# EAGLE design StackBreakoutConnection_4layers_V1.0_with_PicoBlade (EAGLE 9.6.2)

## Sheet 1 of 2
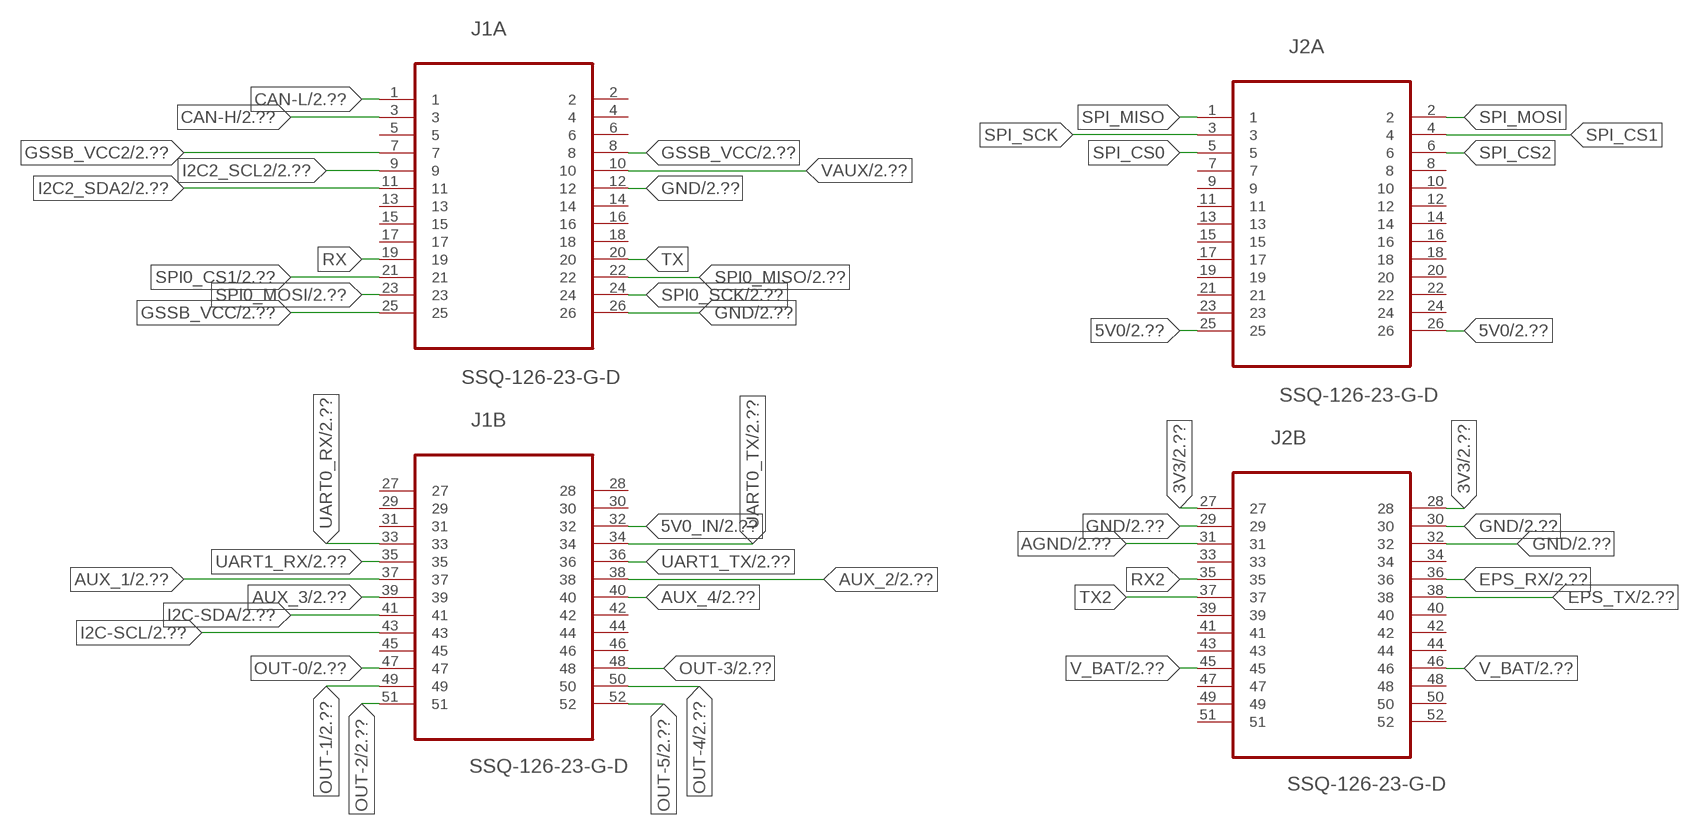
[diagram p0: schematic, sheet 1]

### Parts
J1  SSQ-126-23-G-D  [SAMTEC_SSQ-126-23-G-D]
J2  SSQ-126-23-G-D  [SAMTEC_SSQ-126-23-G-D]

### Nets
3V3: J2.27 J2.28 ; also sheet 2
5V0: J2.25 J2.26 ; also sheet 2
5V0_IN: J1.32 ; also sheet 2
AGND: J2.31 ; also sheet 2
AUX_1: J1.37 ; also sheet 2
AUX_2: J1.38 ; also sheet 2
AUX_3: J1.39 ; also sheet 2
AUX_4: J1.40 ; also sheet 2
CAN-H: J1.3 ; also sheet 2
CAN-L: J1.1 ; also sheet 2
EPS_RX: J2.36 ; also sheet 2
EPS_TX: J2.38 ; also sheet 2
GND: J1.12 J1.26 J2.29 J2.30 J2.32 ; also sheet 2
GSSB_VCC: J1.8 J1.25 ; also sheet 2
GSSB_VCC2: J1.7 ; also sheet 2
I2C2_SCL2: J1.9 ; also sheet 2
I2C2_SDA2: J1.11 ; also sheet 2
I2C-SCL: J1.43 ; also sheet 2
I2C-SDA: J1.41 ; also sheet 2
OUT-0: J1.47 ; also sheet 2
OUT-1: J1.49 ; also sheet 2
OUT-2: J1.51 ; also sheet 2
OUT-3: J1.48 ; also sheet 2
OUT-4: J1.50 ; also sheet 2
OUT-5: J1.52 ; also sheet 2
RX: J1.19
RX2: J2.35
SPI0_CS1: J1.21 ; also sheet 2
SPI0_MISO: J1.22 ; also sheet 2
SPI0_MOSI: J1.23 ; also sheet 2
SPI0_SCK: J1.24 ; also sheet 2
SPI_CS0: J2.5
SPI_CS1: J2.4
SPI_CS2: J2.6
SPI_MISO: J2.1
SPI_MOSI: J2.2
SPI_SCK: J2.3
TX: J1.20
TX2: J2.37
UART0_RX: J1.33 ; also sheet 2
UART0_TX: J1.34 ; also sheet 2
UART1_RX: J1.35 ; also sheet 2
UART1_TX: J1.36 ; also sheet 2
V_BAT: J2.45 J2.46 ; also sheet 2
VAUX: J1.10 ; also sheet 2
Unconnected: J1.2 J1.4 J1.5 J1.6 J1.13 J1.14 J1.15 J1.16 J1.17 J1.18 J1.27 J1.28 J1.29 J1.30 J1.31 J1.42 J1.44 J1.45 J1.46 J2.7 J2.8 J2.9 J2.10 J2.11 J2.12 J2.13 J2.14 J2.15 J2.16 J2.17 J2.18 J2.19 J2.20 J2.21 J2.22 J2.23 J2.24 J2.33 J2.34 J2.39 J2.40 J2.41 J2.42 J2.43 J2.44 J2.47 J2.48 J2.49 J2.50 J2.51 J2.52

## Sheet 2 of 2
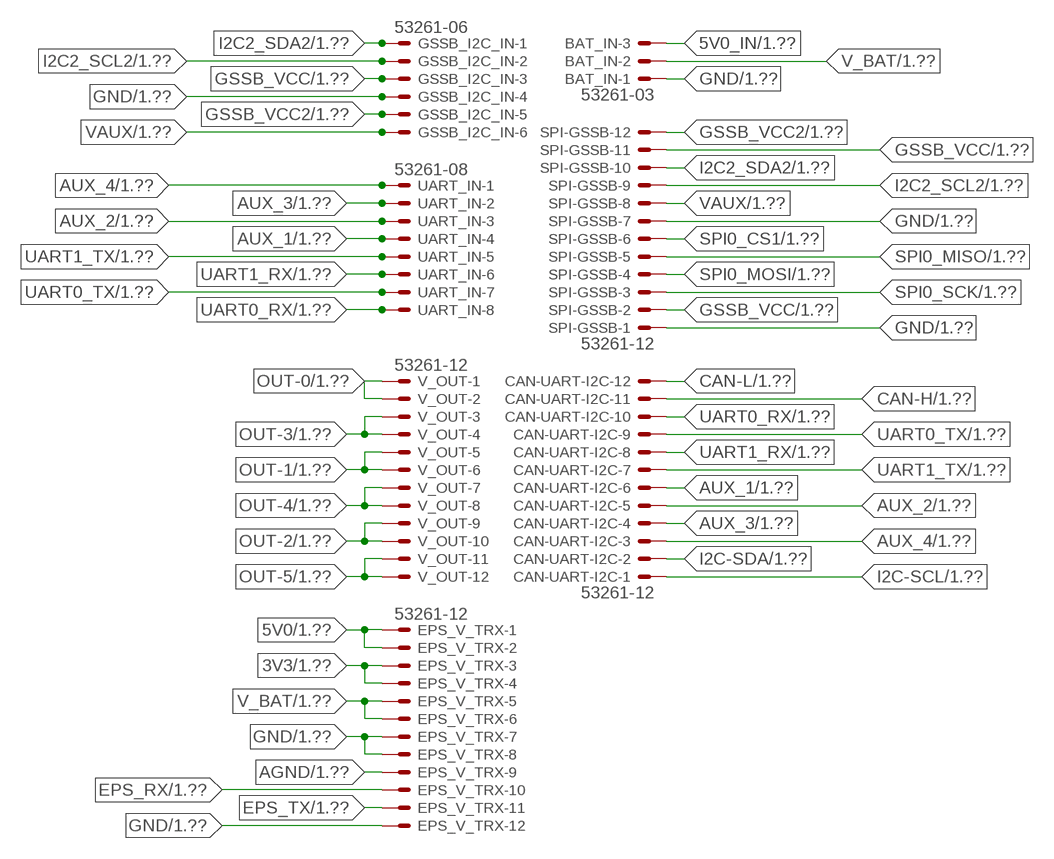
[diagram p1: schematic, sheet 2]

### Parts
BAT_IN  53261-03  [53261-03]
CAN-UART-I2C  53261-12  [53261-12]
EPS_V_TRX  53261-12  [53261-12]
GSSB_I2C_IN  53261-06  [53261-06]
SPI-GSSB  53261-12  [53261-12]
UART_IN  53261-08  [53261-08]
V_OUT  53261-12  [53261-12]

### Nets
3V3: EPS_V_TRX.3 EPS_V_TRX.4 ; also sheet 1
5V0: EPS_V_TRX.1 EPS_V_TRX.2 ; also sheet 1
5V0_IN: BAT_IN.3 ; also sheet 1
AGND: EPS_V_TRX.9 ; also sheet 1
AUX_1: CAN-UART-I2C.6 UART_IN.4 ; also sheet 1
AUX_2: CAN-UART-I2C.5 UART_IN.3 ; also sheet 1
AUX_3: CAN-UART-I2C.4 UART_IN.2 ; also sheet 1
AUX_4: CAN-UART-I2C.3 UART_IN.1 ; also sheet 1
CAN-H: CAN-UART-I2C.11 ; also sheet 1
CAN-L: CAN-UART-I2C.12 ; also sheet 1
EPS_RX: EPS_V_TRX.10 ; also sheet 1
EPS_TX: EPS_V_TRX.11 ; also sheet 1
GND: BAT_IN.1 EPS_V_TRX.7 EPS_V_TRX.8 EPS_V_TRX.12 GSSB_I2C_IN.4 SPI-GSSB.1 SPI-GSSB.7 ; also sheet 1
GSSB_VCC: GSSB_I2C_IN.3 SPI-GSSB.2 SPI-GSSB.11 ; also sheet 1
GSSB_VCC2: GSSB_I2C_IN.5 SPI-GSSB.12 ; also sheet 1
I2C2_SCL2: GSSB_I2C_IN.2 SPI-GSSB.9 ; also sheet 1
I2C2_SDA2: GSSB_I2C_IN.1 SPI-GSSB.10 ; also sheet 1
I2C-SCL: CAN-UART-I2C.1 ; also sheet 1
I2C-SDA: CAN-UART-I2C.2 ; also sheet 1
OUT-0: V_OUT.1 V_OUT.2 ; also sheet 1
OUT-1: V_OUT.5 V_OUT.6 ; also sheet 1
OUT-2: V_OUT.9 V_OUT.10 ; also sheet 1
OUT-3: V_OUT.3 V_OUT.4 ; also sheet 1
OUT-4: V_OUT.7 V_OUT.8 ; also sheet 1
OUT-5: V_OUT.11 V_OUT.12 ; also sheet 1
SPI0_CS1: SPI-GSSB.6 ; also sheet 1
SPI0_MISO: SPI-GSSB.5 ; also sheet 1
SPI0_MOSI: SPI-GSSB.4 ; also sheet 1
SPI0_SCK: SPI-GSSB.3 ; also sheet 1
UART0_RX: CAN-UART-I2C.10 UART_IN.8 ; also sheet 1
UART0_TX: CAN-UART-I2C.9 UART_IN.7 ; also sheet 1
UART1_RX: CAN-UART-I2C.8 UART_IN.6 ; also sheet 1
UART1_TX: CAN-UART-I2C.7 UART_IN.5 ; also sheet 1
V_BAT: BAT_IN.2 EPS_V_TRX.5 EPS_V_TRX.6 ; also sheet 1
VAUX: GSSB_I2C_IN.6 SPI-GSSB.8 ; also sheet 1

## Library data of the parts
BAT_IN = con-molex:53?-03: CONNECTOR wire to board 1.25 mm (.049 inch) pitch header; MF: MOLEX; MPN: 53261-0390; OC_FARNELL: 1125359; OC_NEWARK: 57H5006
CAN-UART-I2C EPS_V_TRX SPI-GSSB V_OUT = con-molex:53?-12: CONNECTOR wire to board 1.25 mm (.049 inch) pitch header; MF: MOLEX; MPN: 53261-1271; OC_FARNELL: 1125363; OC_NEWARK: 59J0244
GSSB_I2C_IN = con-molex:53?-06: CONNECTOR wire to board 1.25 mm (.049 inch) pitch header; MF: MOLEX; OC_FARNELL: 1125375; OC_NEWARK: unknown
J1 J2 = SPEL:SSQ-126-23-G-D: CONN RECEPTACLE, 2.54MM, DUAL, 52WAY; MPN: SSQ-126-23-G-D; OC_FARNELL: -; OC_NEWARK: 82P0504; PACKAGE: RECEPTACLE, 2.54MM, DUAL, 52WAY; SUPPLIER: Samtec
UART_IN = con-molex:53?-08: CONNECTOR wire to board 1.25 mm (.049 inch) pitch header; MF: MOLEX; OC_FARNELL: 1125376; OC_NEWARK: unknown

## Board
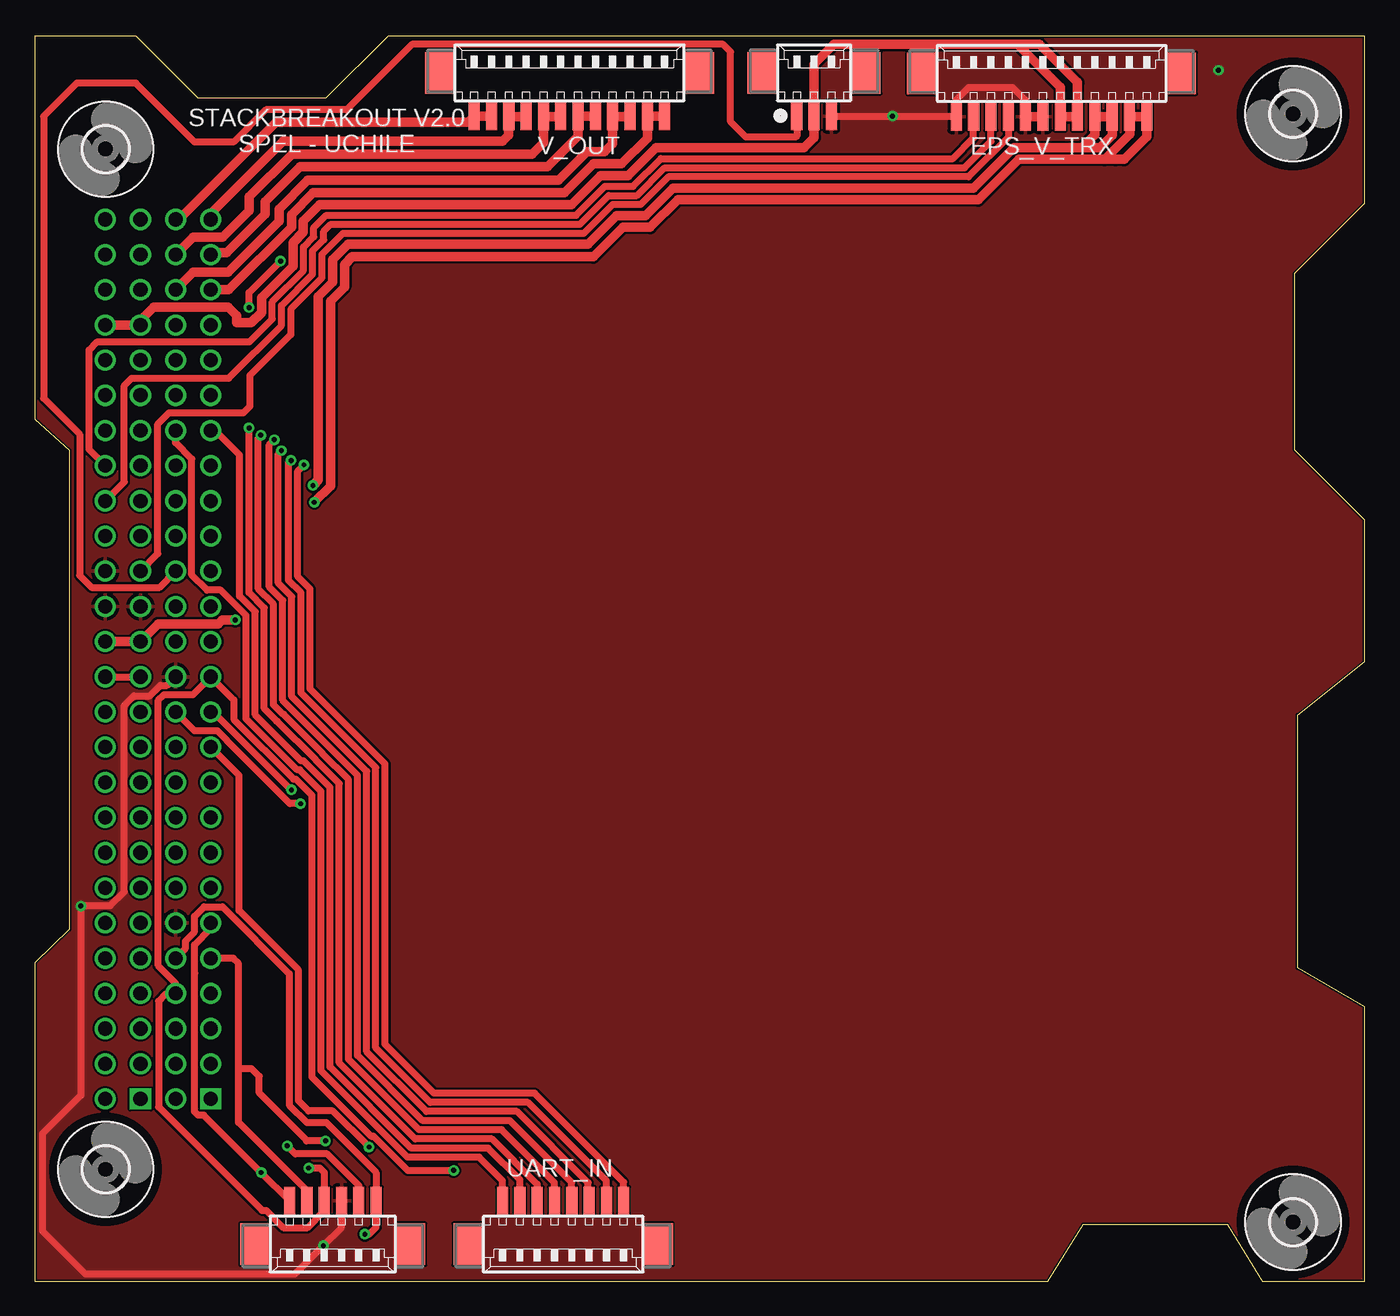
[diagram p2: board, top side]
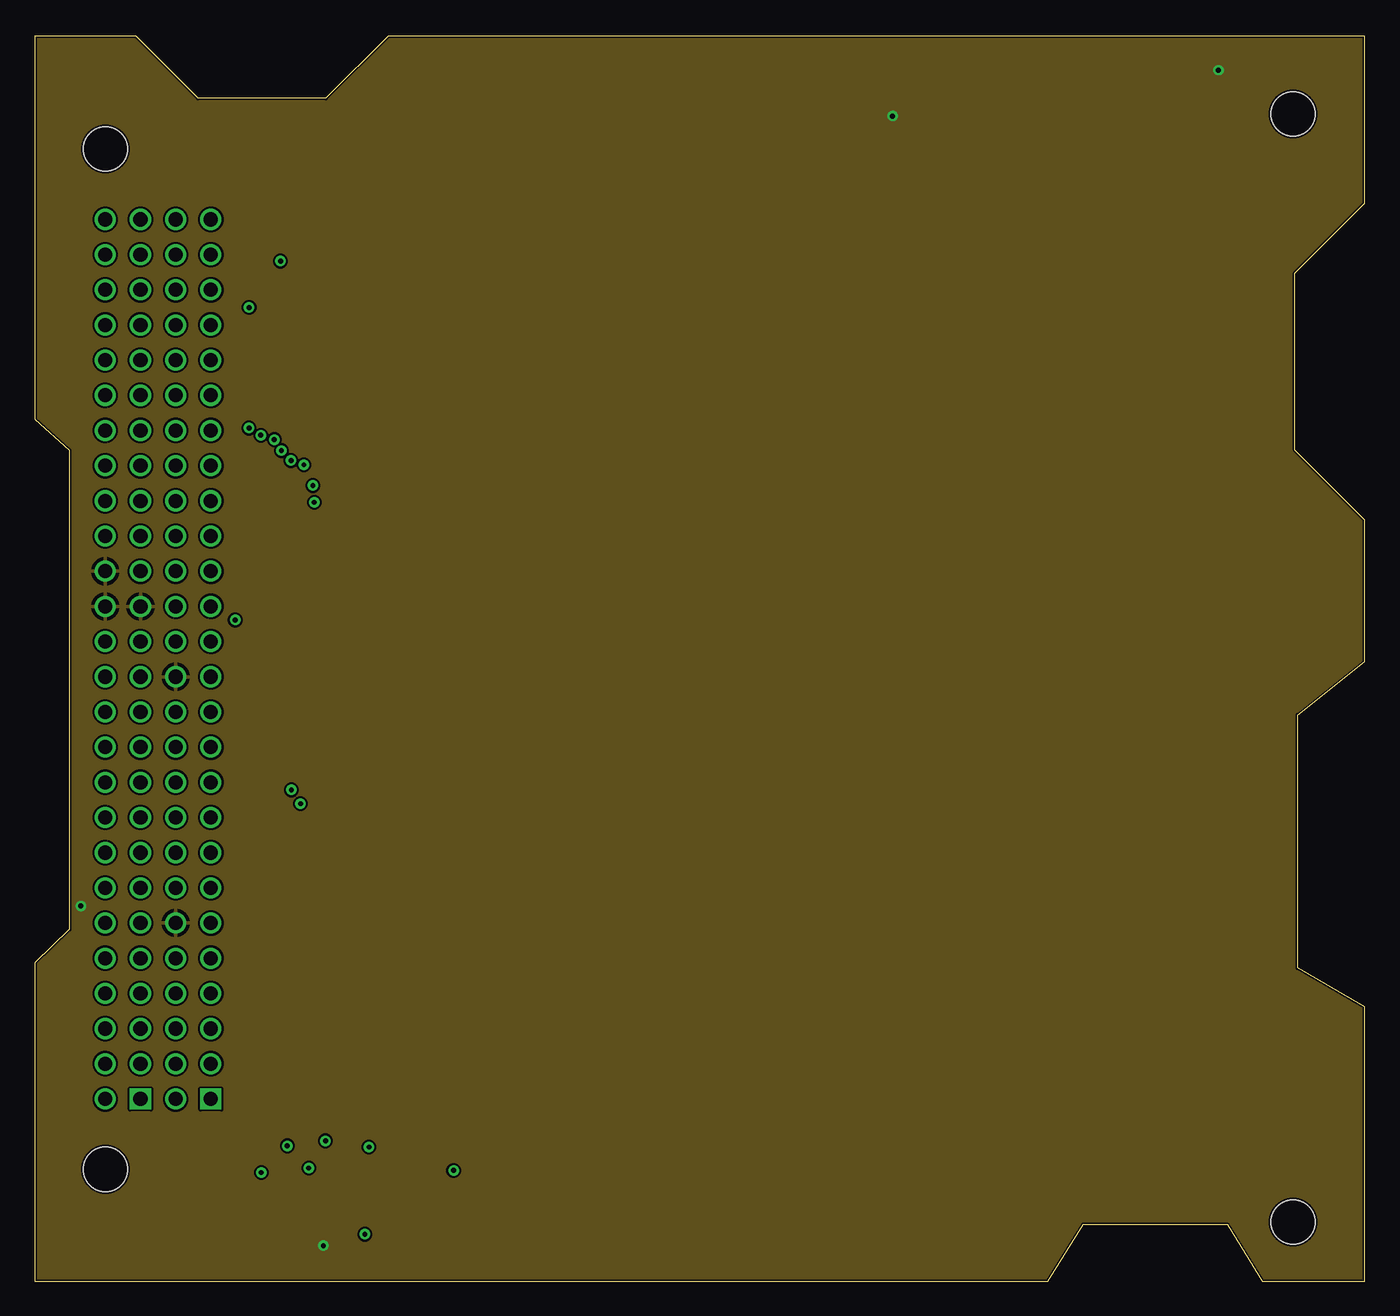
[diagram p3: board, inner layer Route2]
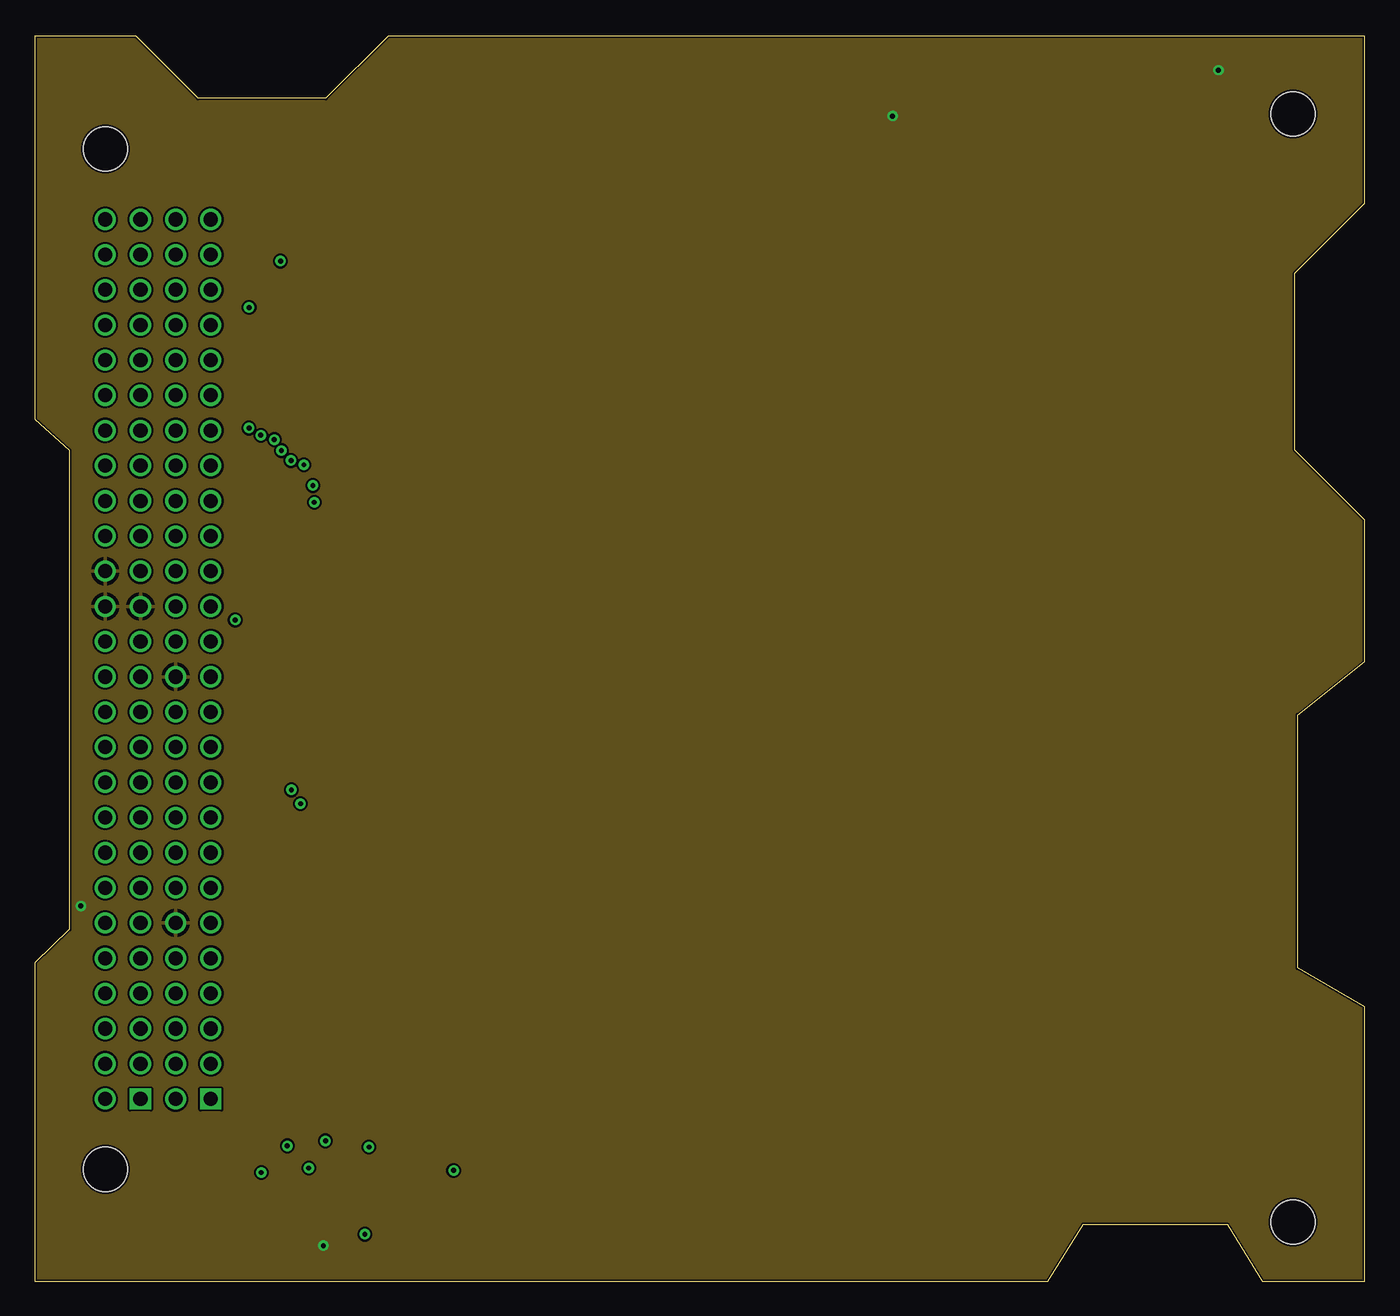
[diagram p4: board, inner layer Route15]
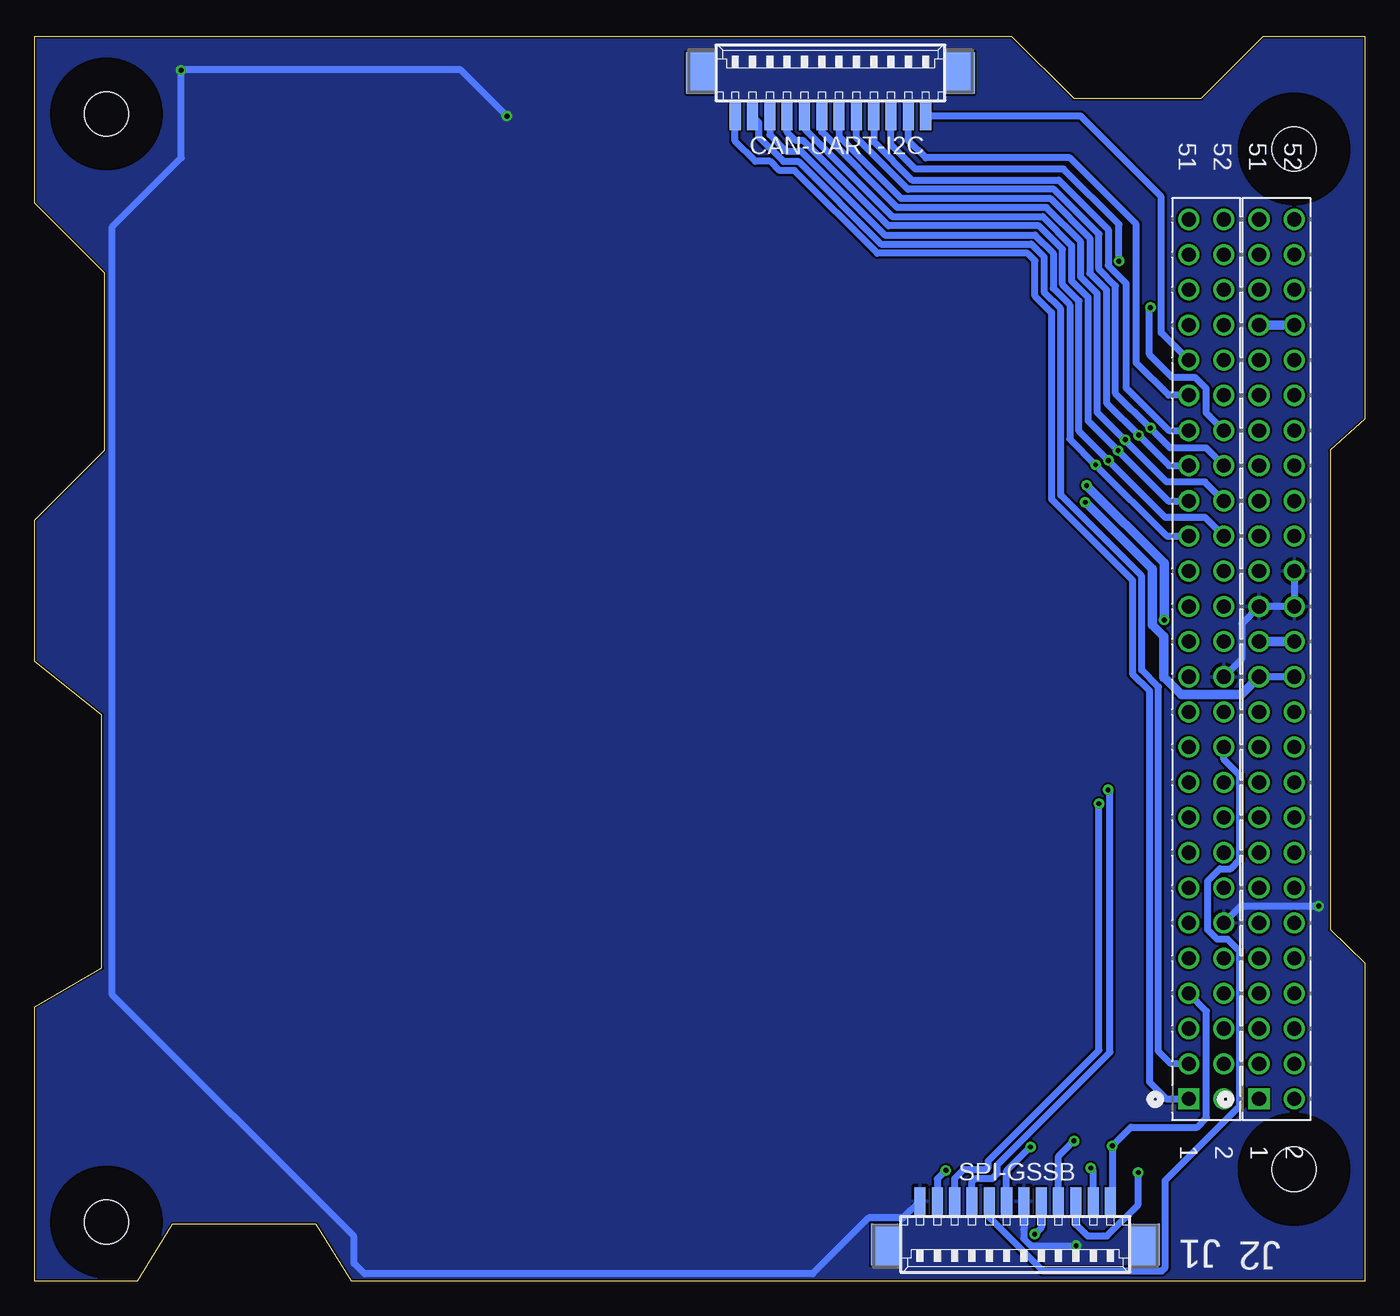
[diagram p5: board, bottom side, seen from below]

Size 96.04 x 89.88 mm. Coordinates in mm from the lower left corner, seen from the top.
Outline: 90.98,72.77 96.04,77.83 96.04,89.88 25.51,89.88 21.02,85.4 11.8,85.4 7.32,89.88 0,89.88 0,62.23 2.5,60 2.5,25.4 0,23 0,0 73.15,0 75.7,4.1 86.09,4.1 88.65,0 96.01,0 96.01,19.81 91.19,22.61 91.19,40.89 96.04,44.76 96.04,54.97 90.98,60.02 90.98,72.77
Copper layers (1+2*15+16): Top 0.035mm / dielectric 1.5mm / Route2 0.035mm / dielectric 0.15mm / Route15 0.035mm / dielectric 0.2mm / Bottom 0.035mm
Design rules "default *": minimum track width 20mil, minimum drill 0.2mm, track to track 6mil, track to pad 6mil, pad to pad 6mil, via to via 6mil, smd to smd 6mil, copper to edge 6mil, drill to drill 6mil, minimum pad ring 10mil, minimum via ring 8mil, stop-mask expansion 4mil, vias tented up to drill 0mil, thermal gap 10mil

### Footprints (pad centres in the part's own frame; a part is rotated, then mirrored left to right if it is on the bottom)
53261-03 = smd 0.8 x 2: 1 1.25,-2.5; 2 0,-2.5; 3 -1.25,-2.5 | smd 2.1 x 3: S1 3.75,0.625; S2 -3.75,0.625
53261-12 = smd 0.8 x 2: 1 6.875,-2.5; 2 5.625,-2.5; 3 4.375,-2.5; 4 3.125,-2.5; 5 1.875,-2.5; 6 0.625,-2.5; 7 -0.625,-2.5; 8 -1.875,-2.5; 9 -3.125,-2.5; 10 -4.375,-2.5; 11 -5.625,-2.5; 12 -6.875,-2.5 | smd 2.1 x 3: S1 9.375,0.625; S2 -9.375,0.625
3,2 = hole 3.2: 0,0
53261-06 = smd 0.8 x 2: 1 3.125,-2.5; 2 1.875,-2.5; 3 0.625,-2.5; 4 -0.625,-2.5; 5 -1.875,-2.5; 6 -3.125,-2.5 | smd 2.1 x 3: S1 5.625,0.625; S2 -5.625,0.625
SAMTEC_SSQ-126-23-G-D = drill 1.016 square: 1 63.5,-2.54 | drill 1.016: 2 63.5,0; 3 60.96,-2.54; 4 60.96,0; 5 58.42,-2.54; 6 58.42,0; 7 55.88,-2.54; 8 55.88,0; 9 53.34,-2.54; 10 53.34,0; 11 50.8,-2.54; 12 50.8,0; 13 48.26,-2.54; 14 48.26,0; 15 45.72,-2.54; 16 45.72,0; 17 43.18,-2.54; 18 43.18,0; 19 40.64,-2.54; 20 40.64,0; 21 38.1,-2.54; 22 38.1,0; 23 35.56,-2.54; 24 35.56,0; 25 33.02,-2.54; 26 33.02,0; 27 30.48,-2.54; 28 30.48,0; 29 27.94,-2.54; 30 27.94,0; 31 25.4,-2.54; 32 25.4,0; 33 22.86,-2.54; 34 22.86,0; 35 20.32,-2.54; 36 20.32,0; 37 17.78,-2.54; 38 17.78,0; 39 15.24,-2.54; 40 15.24,0; 41 12.7,-2.54; 42 12.7,0; 43 10.16,-2.54; 44 10.16,0; 45 7.62,-2.54; 46 7.62,0; 47 5.08,-2.54; 48 5.08,0; 49 2.54,-2.54; 50 2.54,0; 51 0,-2.54; 52 0,0
53261-08 = smd 0.8 x 2: 1 4.375,-2.5; 2 3.125,-2.5; 3 1.875,-2.5; 4 0.625,-2.5; 5 -0.625,-2.5; 6 -1.875,-2.5; 7 -3.125,-2.5; 8 -4.375,-2.5 | smd 2.1 x 3: S1 6.875,0.625; S2 -6.875,0.625

### Placement (x,y rotation side)
BAT_IN  56.27,86.62 0 top
CAN-UART-I2C  38.58,86.62 0 bottom
EPS_V_TRX  73.42,86.58 0 top
GND  [3,2]  90.85,4.27 0 top
GSSB_I2C_IN  21.53,3.3 180 top
J1  10.18,76.66 270 bottom
J2  5.1,76.66 270 bottom
SPI-GSSB  25.24,3.28 180 bottom
U$1  [3,2]  5.12,81.74 0 top
U$2  [3,2]  90.85,84.28 0 top
U$4  [3,2]  5.12,8.08 0 top
UART_IN  38.16,3.3 180 top
V_OUT  38.61,86.61 0 top

### Tracks (layer width: path | path; a pad name or v marks a point on that pad's centre or on a via)
3V3  (via drill 0.35)
  Top 0.7: J2.28 J2.27 | J2.27 7.82,46.18 | 75.6,81.85 70.7,81.85 67.78,78.93 46.08,78.93 44.09,76.94 42.03,76.94 39.96,74.87 22.64,74.87 21.52,73.76 21.52,72.13 20.48,71.09 20.48,57.84 v20.09,57.45 | 75.6,81.85 76.54,82.79 EPS_V_TRX.4 EPS_V_TRX.3 77.79,82.74 76.9,81.85 75.6,81.85 | v14.48,47.74 13.53,47.74 13.24,47.46 8.92,47.46 J2.27
  Bottom 0.7: J2.28 J2.27 | v20.09,57.45 14.48,51.84 v14.48,47.74
5V0  (via drill 0.35)
  Top 0.508: J2.26 J2.25
  Top 0.7: 77.25,81 79.06,82.81 79.06,84.05 EPS_V_TRX.2 EPS_V_TRX.1 80.29,82.63 78.66,81 78.03,81 77.25,81 | 77.25,81 71.06,81 68.14,78.08 46.43,78.08 44.44,76.09 42.47,76.09 40.34,73.96 22.93,73.96 22.37,73.4 22.37,71.77 21.35,70.75 21.35,57.4 v20.19,56.24
  Bottom 0.508: J2.26 J2.25
  Bottom 0.7: v20.19,56.24 15.36,51.41 15.36,47.38 14.52,46.53 14.52,43.6 14.47,43.6 13.24,42.38 8.9,42.38 J2.25
5V0_IN
  Top 0.508: BAT_IN.3 55.02,82.67 54.95,82.6 51.35,82.6 50.25,83.7 50.25,88.75 49.7,89.3 27.25,89.3 22.52,84.57 16.68,84.57 14.36,82.25 11.55,82.25 7.3,86.5 3.05,86.5 0.65,84.1 0.65,63.75 3.25,61.15 3.25,50.95 4.11,50.09 9.01,50.09 J1.32
AGND
  Top 0.508: EPS_V_TRX.9 70.29,82.59 67.43,79.73 45.76,79.73 43.76,77.73 41.72,77.73 39.63,75.64 22.25,75.64 20.73,74.12 20.73,72.42 18.49,70.18 18.49,68.34 15.56,65.41 15.56,63.18 15.08,62.7 9.7,62.7 8.9,61.9 8.9,52.52 J2.31
AUX_1  (via drill 0.35)
  Top 0.508: UART_IN.4 37.53,7.12 33.72,10.93 27.74,10.93 22.65,16.02 22.65,36.21 20.79,38.07 20.79,38.12 17.99,40.92 17.94,40.92 17.25,41.62 17.25,48.89 16.14,49.99 16.14,60.89 v16.33,61.08
  Bottom 0.508: CAN-UART-I2C.6 37.96,82.66 33.48,78.18 22.71,78.18 19.86,75.32 19.86,72.78 18.66,71.58 18.66,63.41 v16.33,61.08 14.13,58.88 J1.37
AUX_2  (via drill 0.35)
  Top 0.508: UART_IN.3 36.29,7.01 33.02,10.27 27.47,10.27 21.99,15.75 21.99,35.92 20.31,37.61 20.31,37.62 17.51,40.42 | 17.51,40.42 17.47,40.42 | 17.51,40.42 16.59,41.34 16.59,48.61 15.48,49.72 v15.48,61.6
  Bottom 0.508: J1.38 11.45,60.15 14.05,60.15 15.48,61.58 | 15.48,61.58 18,64.1 18,71.86 19.2,73.05 19.2,75.59 22.44,78.84 32.97,78.84 36.71,82.57 CAN-UART-I2C.5 | v15.48,61.6 15.48,61.58
AUX_3
  Top 0.508: UART_IN.2 35.03,7.33 32.75,9.61 27.2,9.61 21.33,15.48 21.33,35.65 19.41,37.58 19.23,37.58 15.93,40.88 15.93,48.34 14.8,49.46 14.8,59.65 13.03,61.42 J1.39
  Bottom 0.508: CAN-UART-I2C.4 35.46,82.26 32.7,79.5 22.1,79.5 18.54,75.94 18.54,73.33 17.25,72.04 17.25,64.5 14.17,61.42 J1.39
AUX_4  (via drill 0.35)
  Top 0.508: v15.48,70.3 15.48,71.39 v17.75,73.65 | UART_IN.1 33.78,7.26 32.09,8.95 26.92,8.95 20.67,15.2 20.67,35.38 19.13,36.91 18.96,36.91 15.27,40.61 15.27,48.06 13.44,49.89 12.44,49.89 11.35,50.98 11.35,59.36 10.18,60.53 J1.40
  Bottom 0.508: J1.40 11.45,62.69 11.45,64.45 12.25,65.25 13.9,65.25 15.55,66.9 15.55,70.23 v15.48,70.3 | v17.75,73.65 17.75,76.3 21.75,80.3 32.45,80.3 34.21,82.06 CAN-UART-I2C.3
CAN-H
  Bottom 0.508: CAN-UART-I2C.11 43.77,83.67 43.77,82.63 41.98,80.85 40.9,80.85 34.93,74.88 24.08,74.88 23.16,73.95 23.16,71.41 21.96,70.22 21.96,56.74 16.12,50.9 16.12,44.13 14.9,42.91 14.9,16.6 14,15.7 J1.3
CAN-L
  Bottom 0.508: CAN-UART-I2C.12 45.46,82.31 44,80.85 42.92,80.85 42.26,80.19 41.17,80.19 35.2,74.22 24.35,74.22 23.82,73.68 23.82,71.14 22.62,69.94 22.62,56.47 16.78,50.62 16.78,43.85 15.56,42.64 15.56,14.39 14.32,13.15 J1.1
EPS_RX
  Top 0.508: J2.36 6.47,57.71 6.47,64.67 7,65.2 14.02,65.2 17.82,69 17.82,70.44 20.07,72.69 20.07,74.39 20.87,75.19 20.87,75.8 21.37,76.3 39.36,76.3 41.45,78.39 43.48,78.39 45.48,80.39 67.14,80.39 69.04,82.29 EPS_V_TRX.10
EPS_TX
  Top 0.508: EPS_V_TRX.11 67.79,82.54 66.3,81.05 45.21,81.05 43.21,79.05 41.18,79.05 39.09,76.96 21.05,76.96 20.16,76.07 20.16,75.41 19.41,74.67 19.41,72.97 17.15,70.71 17.15,69.47 15.52,67.83 4.53,67.83 3.93,67.23 3.93,60.05 J2.38
GND  (via drill 0.35)
  Top 0.508: BAT_IN.1 v61.94,84.12 66.5,84.12 EPS_V_TRX.12 66.54,85.29 67.45,86.2 70.6,86.2 71.54,85.26 EPS_V_TRX.8 | J1.26 9.56,43.02 9.07,43.02 8.31,42.27 7.16,42.27 6.47,41.58 6.47,28.12 5.47,27.12 3.33,27.12 v3.33,27.09 3.33,13.42 0.56,10.65 0.56,3.63 3.67,0.52 18.8,0.52 v20.84,2.56 22.15,3.87 GSSB_I2C_IN.4
  Top 0.7: EPS_V_TRX.8 EPS_V_TRX.7
  Bottom 0.508: J2.32 J2.30 J2.29 8.9,47.46 8.9,44.92 J1.26 | v61.94,84.12 65.27,87.45 85.44,87.45 | 85.44,87.45 v85.46,87.43 | J1.12 8.96,27.08 3.66,27.08 3.65,27.09 v3.33,27.09 | v20.84,2.56 24.12,2.56 24.62,3.06 24.62,3.71 24.61,3.73 SPI-GSSB.7 | 32.1,5.77 SPI-GSSB.1 33.33,4.56 35.83,4.56 39.88,0.52 72.21,0.52 72.98,1.29 72.98,3.23 90.42,20.67 90.42,76.13 85.44,81.11 85.44,87.45
  pour Route15: -0.22,90.12 7.77,90.12 7.77,90.04 12.04,85.77 20.96,85.77 26.02,90.83 96.4,90.83 96.71,90.52 96.71,77.77 91.45,72.52 91.45,60.39 96.5,55.34 96.5,44.84 91.56,39.9 91.56,22.84 96.45,20.03 96.45,-0.36 88.28,-0.36 85.72,3.61 76.26,3.61 73.9,-0.36 -0.35,-0.36 -0.35,23.1 2.23,25.67 2.23,59.72 -0.23,62.18 -0.23,90.12 -0.23,90.12
  pour Top: -0.25,-0.13 73.41,-0.13 76.03,3.81 85.89,3.81 88.6,-0.25 96.27,-0.25 96.27,20.57 91.44,22.99 91.44,40.58 96.27,44.2 96.27,55.24 91.31,60.2 91.31,72.64 96.39,77.72 96.39,90.17 24.89,90.17 20.57,85.85 11.65,85.85 8.22,90.42 -0.25,90.42 -0.25,62.23 2.29,59.69 2.29,25.65 -0.25,23.11
  pour Route2: -0.46,-0.28 73.46,-0.28 76.08,3.66 85.9,3.66 88.53,-0.28 96.32,-0.28 96.32,20.42 91.87,22.64 91.87,40.87 96.32,44.2 96.32,55.22 91.36,60.17 91.36,72.62 96.44,77.7 96.44,90.4 25.32,90.4 20.75,85.83 11.77,85.83 8.62,90.02 -0.2,90.02 -0.2,62.33 2.08,60.05 2.08,25.88 -0.46,23.34
  pour Bottom: -0.27,90.34 7.08,90.34 7.08,90.4 11.74,85.74 11.74,85.86 20.77,85.86 26.09,91.18 95.59,91.18 96.65,90.11 96.65,77.24 91.53,72.11 91.53,60.11 96.71,54.93 96.71,44.56 91.64,39.49 91.64,22.93 96.27,20.25 96.27,-0.51 88.48,-0.51 85.92,3.45 76.54,3.45 74.18,-0.51 -0.4,-0.51 -0.4,23.33 2.18,25.9 2.18,59.57 -0.28,62.03 -0.28,90.35 -0.28,90.35
GSSB_VCC  (via drill 0.35)
  Top 0.508: v19.79,8.17 20.59,8.17 20.9,7.86 GSSB_I2C_IN.3 20.9,5.08 19.7,3.87 17.96,3.87 16.72,5.11 16.41,5.11 8.94,12.58 8.94,20.21 9.51,20.78 J1.8 10.18,21.52 8.93,22.77 8.93,41.95 9.34,42.36 11.44,42.36 J1.25 14.38,41.98 14.38,40.56 18.68,36.26 18.86,36.26 20.01,35.1 20.01,14.75 24.29,10.47 24.46,10.47 26.94,8 v30.25,8
  Bottom 0.508: SPI-GSSB.11 19.61,8 v19.79,8.17 | v30.25,8 30.86,7.38 SPI-GSSB.2
GSSB_VCC2  (via drill 0.35)
  Top 0.508: GSSB_I2C_IN.5 23.4,6.91 21.12,9.19 18.82,9.19 v18.24,9.77
  Bottom 0.508: v18.24,9.77 18.36,9.65 | 18.36,5.79 SPI-GSSB.12 18.24,5.91 v18.24,9.77 | v18.24,9.77 16.89,11.12 12.11,11.12 11.43,11.8 11.43,19.49 J1.7
I2C2_SCL2  (via drill 0.35)
  Top 0.508: GSSB_I2C_IN.2 19.66,6.52 14.72,11.46 14.72,15.35 | 14.72,15.35 14.72,22.94 14.34,23.32 J1.9 | v21,10.13 19.63,10.13 19.65,10.15 16.21,13.6 16.21,14.8 15.66,15.35 14.72,15.35
  Bottom 0.508: SPI-GSSB.9 22.11,9.02 v21,10.13
I2C2_SDA2  (via drill 0.35)
  Top 0.508: GSSB_I2C_IN.1 v16.36,7.84 12.21,11.99 11.79,11.99 11.55,12.23 11.55,22.22 | 11.55,22.22 11.56,22.23 | 11.55,22.22 11.55,24.29 12.72,25.46 J1.11
  Bottom 0.508: SPI-GSSB.10 20.86,4.11 20.03,3.27 18.62,3.27 16.36,5.53 v16.36,7.84
I2C-SCL
  Bottom 0.508: J1.43 14.7,68.48 14.7,78.3 20.52,84.12 CAN-UART-I2C.1
I2C-SDA
  Bottom 0.508: J1.41 14.16,63.96 16.5,66.3 16.5,76.3 21.3,81.1 31.7,81.1 32.96,82.36 CAN-UART-I2C.2
OUT-0
  Top 0.7: V_OUT.1 V_OUT.2 44.23,82.53 42.37,80.67 40.34,80.67 38.25,78.58 20.11,78.58 18.54,77.01 18.54,76.1 14.02,71.58 J1.47
OUT-1
  Top 0.61: J1.49 12.72,74.22 12.76,74.26
  Top 0.7: 12.76,74.26 13.87,74.26 16.65,77.03 16.65,77.92 19.17,80.45 37.01,80.45 39.23,82.67 V_OUT.6 V_OUT.5
OUT-2
  Top 0.508: 34.23,84.07 V_OUT.10 | V_OUT.9 35.44,84.07
  Top 0.61: J1.51 12.64,76.74 12.64,76.99
  Top 0.7: 12.64,76.99 17.95,82.3 33.78,82.3 34.23,82.75 34.23,84.07 35.44,84.07
OUT-3
  Top 0.508: 41.73,84.07 V_OUT.4 | V_OUT.3 42.94,84.07
  Top 0.7: 42.94,84.07 41.73,84.07 41.73,82.12 41.15,81.53 39.88,81.53 37.83,79.48 19.72,79.48 17.66,77.42 17.66,76.55 13.96,72.85 11.45,72.85 J1.48
OUT-4
  Top 0.508: 36.73,84.07 V_OUT.8 | V_OUT.7 37.94,84.07
  Top 0.7: 37.94,84.07 36.73,84.07 36.73,82.2 35.9,81.37 18.57,81.37 15.49,78.29 15.49,77.3 13.58,75.39 11.45,75.39 J1.50
OUT-5
  Top 0.61: J1.52 10.44,76.66
  Top 0.7: 10.44,76.66 17.45,83.66 31.28,83.66 V_OUT.12 V_OUT.11
SPI0_CS1  (via drill 0.35)
  Top 0.508: v24.14,9.69 21.53,12.3 19.78,12.3 19.05,13.03 19.05,22.47 14.76,26.76 14.76,36.52 J1.21
  Bottom 0.508: SPI-GSSB.6 25.86,7.96 v24.14,9.69
SPI0_MISO
  Bottom 0.508: SPI-GSSB.5 27.1,5.77 27.1,4.61 23.24,0.75 14.65,0.75 14.41,0.99 14.41,7.28 9.01,12.68 9.01,23.8 9.9,24.69 10.66,24.69 11.35,25.38 11.35,28.88 10.46,29.77 9.7,29.77 9.01,30.46 9.01,36.5 10.18,37.67 J1.22
SPI0_MOSI  (via drill 0.35)
  Top 0.508: v18.54,35.47 12.9,41.1 J1.23
  Bottom 0.508: SPI-GSSB.4 28.36,7.17 28.11,7.42 26.88,7.42 26.52,7.78 26.52,8.41 18.41,16.53 18.41,35.35 v18.54,35.47
SPI0_SCK  (via drill 0.35)
  Top 0.508: J1.24 11.55,39.73 13.2,39.73 13.89,39.04 13.89,39.01 18.41,34.48 v19.2,34.48
  Bottom 0.508: SPI-GSSB.3 29.61,7.42 28.95,8.08 27.3,8.08 27.19,8.2 27.19,8.69 19.2,16.68 v19.2,34.48
UART0_RX  (via drill 0.35)
  Top 0.508: UART_IN.8 42.53,7.15 36.11,13.57 28.84,13.57 25.29,17.12 25.29,37.35 19.89,42.76 19.89,49.98 18.99,50.88 18.99,58.49 v19.44,58.94
  Bottom 0.508: CAN-UART-I2C.10 42.96,82.76 41.8,81.6 40.72,81.6 34.66,75.54 23.81,75.54 22.5,74.23 22.5,71.68 21.3,70.49 21.3,60.8 v19.44,58.94 14.3,53.8 J1.33
UART0_TX  (via drill 0.35)
  Top 0.508: UART_IN.7 41.28,7.25 35.62,12.91 28.57,12.91 24.63,16.84 24.63,37.08 19.23,42.48 19.23,49.71 18.33,50.6 18.33,59.07 v18.51,59.25
  Bottom 0.508: J1.34 11.53,55.15 14.41,55.15 v18.51,59.25 20.64,61.38 20.64,70.76 21.84,71.96 21.84,74.5 23.53,76.2 34.38,76.2 40.53,82.35 41.1,82.35 41.71,82.96 CAN-UART-I2C.9
UART1_RX  (via drill 0.35)
  Top 0.508: UART_IN.6 39.97,5.86 39.97,7.11 34.83,12.25 28.29,12.25 23.97,16.57 23.97,36.81 18.57,42.21 18.57,49.43 17.6,50.4 17.6,59.75 v17.82,59.97
  Bottom 0.508: CAN-UART-I2C.8 40.46,83.21 34.11,76.86 23.26,76.86 21.18,74.77 21.18,72.23 19.98,71.04 19.98,62.13 v17.82,59.97 14.19,56.34 J1.35
UART1_TX  (via drill 0.35)
  Top 0.508: UART_IN.5 38.78,7.13 34.32,11.59 28.02,11.59 23.31,16.3 23.31,36.53 17.91,41.94 17.91,49.16 16.94,50.13 16.94,60.4 v17.3,60.76
  Bottom 0.508: J1.36 11.55,57.71 14.31,57.71 17.35,60.76 | CAN-UART-I2C.7 39.21,82.97 33.75,77.52 22.99,77.52 20.52,75.05 20.52,72.5 19.32,71.31 19.32,62.73 17.35,60.76 | v17.3,60.76 17.35,60.76
V_BAT
  Top 0.508: J2.45 7.49,69.19
  Top 0.7: 70.95,89.3 57.7,89.3 56.27,87.87 BAT_IN.2 56.27,82.57 55.54,81.84 44.86,81.84 42.84,79.81 40.85,79.81 38.76,77.72 20.57,77.72 19.4,76.55 19.4,75.74 18.65,74.99 18.65,73.29 16.38,71.02 16.38,69.94 15.64,69.2 14.6,69.2 14.6,69.7 13.99,70.31 8.61,70.31 7.49,69.19 | 70.95,89.3 74.04,86.21 EPS_V_TRX.6 EPS_V_TRX.5 75.29,86.56 72.55,89.3 70.95,89.3 | J2.46 J2.45
  Bottom 0.7: J2.46 J2.45
VAUX  (via drill 0.35)
  Top 0.508: v23.84,3.39 24.15,3.39 24.65,3.89 GSSB_I2C_IN.6 24.65,7.86 21.05,11.46 19.64,11.46 18.39,12.71 18.39,22.2 13.56,27.03 12.24,27.03 11.55,26.34 11.55,25.23 10.89,24.57 10.89,24.03 J1.10
  Bottom 0.508: SPI-GSSB.8 23.36,3.87 v23.84,3.39

### Text on the board
tPlace: STACKBREAKOUT V2.0 / SPEL - UCHILE